# Altium schematic sheet voeding.SchDoc
size A
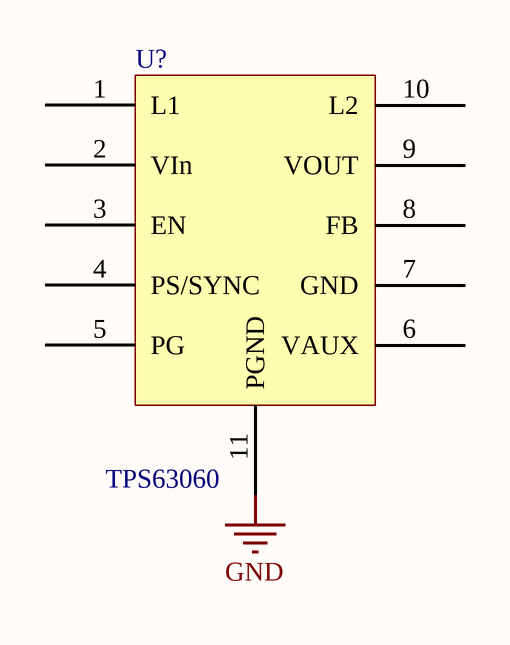
[diagram p0: voeding.SchDoc]

## Parts
U?  TPS63060  [TPS63060]

## Nets
GND: U?.11(PGND)

Not connected (* = marked no-connect by the designer): U? 1(L1) 2(VIn) 3(EN) 4(PS/SYNC) 5(PG) 6(VAUX) 7(GND) 8(FB) 9(VOUT) 10(L2)